# Altium schematic sheet Telemetry.SchDoc
size A4; SheetNumber: 6; SheetTotal: 6
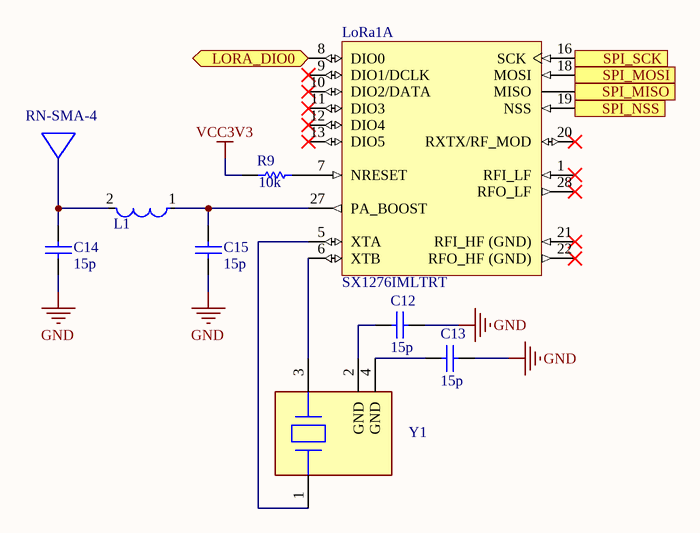
[diagram p0: Telemetry.SchDoc]

## Parts
ANT?  RN-SMA-4  [FP-RN-SMA-4-MFG]
C12  value 15p  (hidden comment: Capacitor)
C13  value 15p  (hidden comment: Capacitor)
C14  value 15p  (hidden comment: Capacitor)
C15  value 15p  (hidden comment: Capacitor)
L1  LQW31HN27NJ03L  [FP-LQW31HN_03-MFG]  (value not drawn)
LoRa1  SX1276IMLTRT  [SMTC-QFN-28_V]  (part A of 2)
R9  value 10k  (hidden comment: Resistor)
Y1  (no value)  [FP-ABM11AIG-MFG]

## Ports
LORA_DIO0 (bidir), SPI_MISO (out), SPI_MOSI (in), SPI_NSS (in), SPI_SCK (in)

## Nets
GND: C12.2 C13.2 C14.1 C15.1
VCC3V3: R9.1
LORA_DIO0: LoRa1.8(DIO0) ; port LORA_DIO0
SPI_MISO: LoRa1.17(MISO) ; port SPI_MISO
SPI_MOSI: LoRa1.18(MOSI) ; port SPI_MOSI
SPI_NSS: LoRa1.19(NSS) ; port SPI_NSS
SPI_SCK: LoRa1.16(SCK) ; port SPI_SCK
NetC12_1: C12.1 Y1.2(GND)
NetC13_1: C13.1 Y1.4(GND)
NetC14_2: C14.2 L1.2
NetC15_2: C15.2 L1.1 LoRa1.27(PA_BOOST)
NetLoRa1_5: LoRa1.5(XTA) Y1.1(1_Crystal)
NetLoRa1_6: LoRa1.6(XTB) Y1.3(2_Crystal)
NetLoRa1_7: LoRa1.7(NRESET) R9.2

Not connected (* = marked no-connect by the designer): LoRa1 1(RFI_LF)* 9(DIO1/DCLK)* 10(DIO2/DATA)* 11(DIO3)* 12(DIO4)* 13(DIO5)* 20(RXTX/RF_MOD)* 21(RFI_HF_(GND))* 22(RFO_HF_(GND))* 28(RFO_LF)*

## Library data of the parts
ANT? = CMP-06329-000002-1: RF ANT 2.4GHZ WHIP SMA MALE 4"; Number of Bands: 1; Input Impedance: 50R; VSWR: 1.9; Bandwidth: 120MHz; Frequency: 2.45GHz; REACH SVHC: No SVHC; Height: 4.449inch; Packaging: Bulk; Case/Package: SMA; Package Quantity: 1; Lead Free: Lead Free; Series: -; Termination: SMA; Connector Type: SMA; Radiation Hardening: No; Impedance: 50R; Mount: Connector
C12-C15 = Capacitor: SimulationGenericComponent: True
L1 = CMP-06042-006372-1: Wire Wound RF Inductor 27nH ±5% 0.0714Ω 560mA 1206; Self Resonant Frequency: 1GHz; Shielding: Unshielded; Core Material: Ferrite; Test Frequency: 100MHz; Q Factor: 60; DC Resistance (DCR): 51mR; Mount: Surface Mount; Inductance: 27nH; Max DC Current: 560mA; Military Standard: Not; Height: 1.8mm; Width: 0.063inch; Case Code (Metric): 3216; Height - Seated (Max): 0.079inch; Min Operating Temperature: -40°C; Weight: 0.000705oz; Package Quantity: 2000; Max Operating Temperature: 85°C; Current Rating: 560mA; Case Code (Imperial): 1206; Packaging: Tape and Reel; DC Current: 560mA; Termination: SMD/SMT; Depth: 1.8mm; Resistor Type: Wirewound; Radiation Hardening: No; Case/Package: 1206; Length: 3.2mm; Tolerance: 5%
LoRa1 = CMP-2000-05356-1: Low Power Long Range Transceiver, 137 to 1020 MHz, -40 to 85 degC, 28-Pin QFN, RoHS, Tape and Reel; Manufacturer: Semtech; Power - Output: 20dBm; Data Rate (Max): 300kbps; Sensitivity: -148dBm; Featured Product: SX1276LongRangeTransceiver; PCN Design/Specification: CopperWire25/Mar/2014; GPIO: 6; Frequency: 137MHz~1.02GHz; Voltage - Supply: 1.8V~3.7V; Protocol: LoRa™; Current - Transmitting: 20mA~120mA; Current - Receiving: 10.8mA~12mA; Online Catalog: SX1276,SX1277andSX1278; Design Resources: SX127xReferenceDesignOverviewDevelopmentToolSelector; Serial Interfaces: SPI; Mfg Application Notes: LoRaModulation:CrystalOscillatorGuidanceSX12xxSoftwareImplementationofDataWhiteningandCRCSX127xLoRaLowEnergyDesignGuideSX127xLoRaModemDesignersGuide; Modulation: FSK,GFSK,GMSK,MSK,OOK; Other Names: SX1276IMLTRTTR; Series: -; Manufacturer URL: http://www.semtech.com/; Datasheet URL: http://www.semtech.com/images/datasheet/sx1276.pdf; Type: TxRx+MCU; RF Family/Standard: 802.15.4; Package Reference: QFN-28; Standard Package: 3,000; Package Description: 28-Pin Quad Flat No-lead Package, Body 6 x 6 mm, Pitch 0.65 mm; Category: RF/IFandRFID; Operating Temperature: -40degC~85degC; Datasheet Version: Rev. 4, 03/2015; Memory Size: -; Family: RFTransceiverICs; Packaging: Tape&Reel(TR); Package / Case: 28-VQFNExposedPad
R9 = Resistor: TC1: 0; SimulationGenericComponent: True; TC2: 0
Y1 = CMP-27762-011048-1: Crystal 32MHz ±30ppm 10pF SMD-4 2.5mm x 2mm Automotive; Frequency Stability: 100ppm; ESR (Equivalent Series Resistance): 80R; Max Operating Temperature: 125°C; Frequency Tolerance: 30ppm; Length: 0.098inch; Frequency: 32MHz; RoHS Compliant: Yes; Min Operating Temperature: -40°C; Width: 0.079inch; Load Capacitance: 10pF; Packaging: Tape and Reel; Height: 0.024inch; Mount: Surface Mount; Case/Package: SMD/SMT; Ratings: AEC-Q200